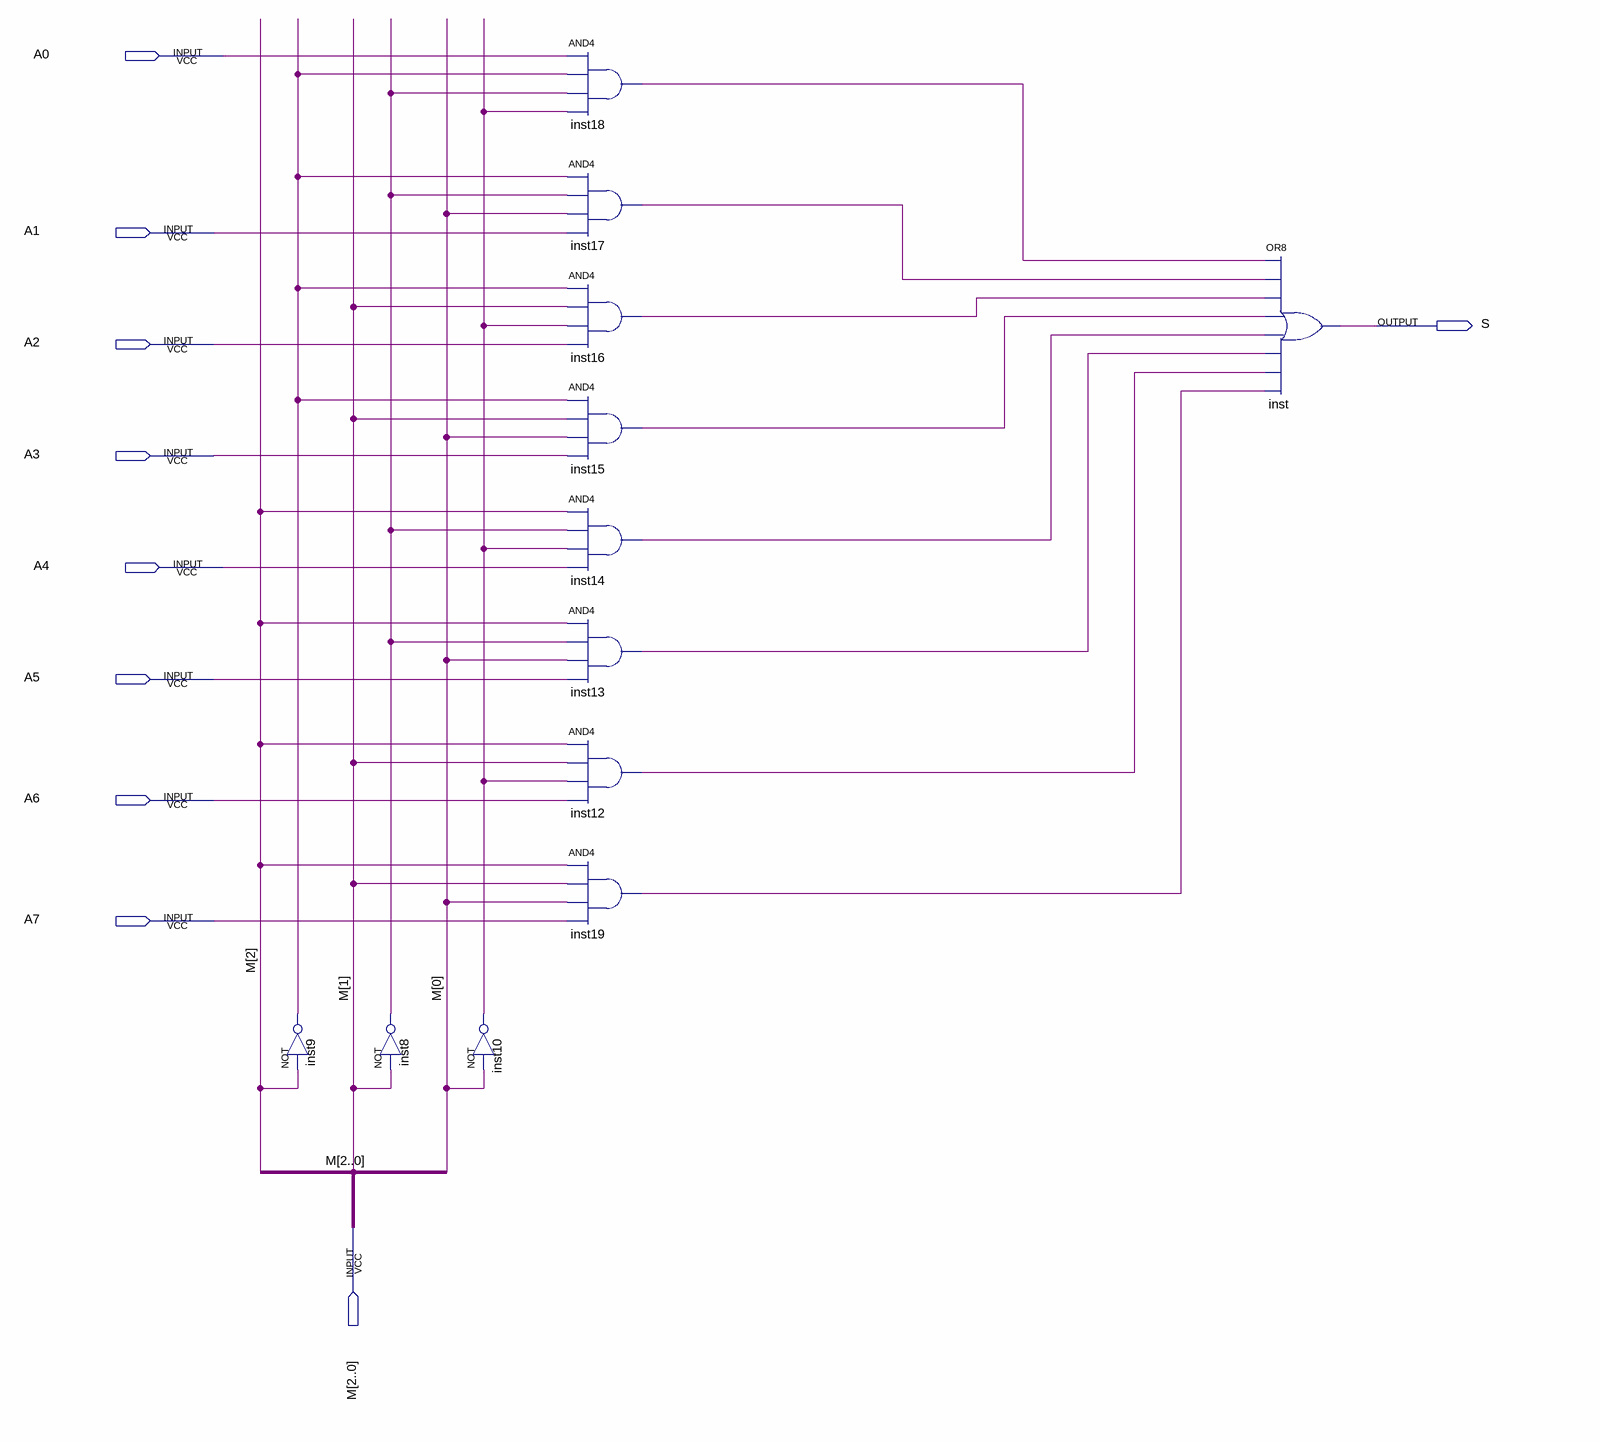
[diagram p0: schematic sheet]
// Quartus schematic mux81.bdf as structural Verilog: 12 symbols, 10 pins
module mux81 (
  input  A0,
  input  A1,
  input  A2,
  input  A3,
  input  A4,
  input  A5,
  input  A6,
  input  A7,
  input  [2:0] M,
  output S
);

  wire inst8_out, inst9_out, inst10_out, inst12_out, inst13_out, inst14_out, inst15_out, inst16_out,
       inst17_out, inst18_out, inst19_out;

  not inst9 (inst9_out, M[2]);
  not inst8 (inst8_out, M[1]);
  not inst10 (inst10_out, M[0]);
  and inst18 (inst18_out, A0, inst9_out, inst8_out, inst10_out);
  and inst17 (inst17_out, inst9_out, inst8_out, M[0], A1);
  and inst16 (inst16_out, inst9_out, M[1], inst10_out, A2);
  and inst15 (inst15_out, inst9_out, M[1], M[0], A3);
  and inst14 (inst14_out, M[2], inst8_out, inst10_out, A4);
  and inst13 (inst13_out, M[2], inst8_out, M[0], A5);
  and inst12 (inst12_out, M[2], M[1], inst10_out, A6);
  and inst19 (inst19_out, M[2], M[1], M[0], A7);
  or inst (S, inst18_out, inst17_out, inst16_out, inst15_out, inst14_out, inst13_out, inst12_out, inst19_out);
endmodule
